# Altium schematic sheet Adafruit Bluefruit LE SPI Friend.SchDoc: Adafruit Bluefruit LE SPI Friend
size 282 x 197 mm; Date: 4/25/2020 9:23:17 PM; SheetNumber: 1; Author: KTOWN; Origin: Eagle; GateName_1: G$1; SymbolName_1: FRAME_A4_ADAFRUIT; LibraryName: microbuilder; DeviceSetName: FRAME_A4_ADAFRUIT; Sheet: Sheet:; AdafruitIndustries: Adafruit Industries; Drawing: Drawing:
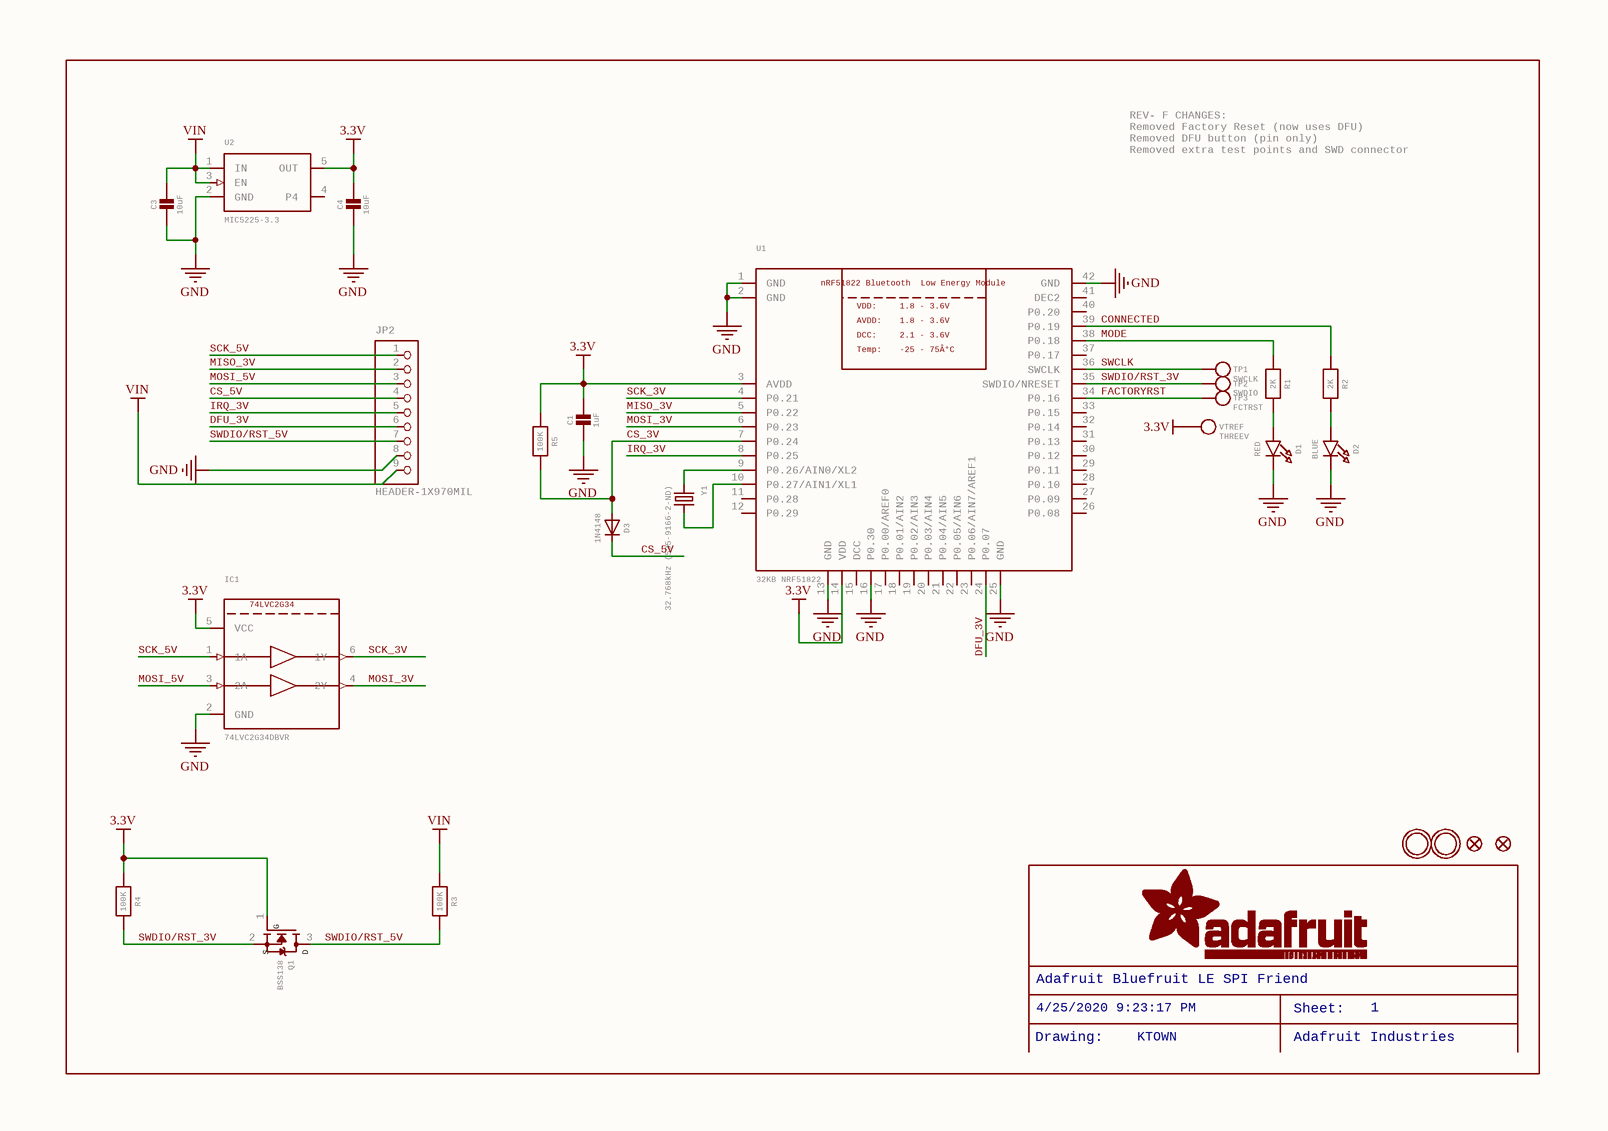
[diagram p0: Adafruit Bluefruit LE SPI Friend.SchDoc]

## Parts
C1  value 1uF  [0805_10MGAP]
C3  value 10uF  [0805-NO]
C4  value 10uF  [0805_10MGAP]
D1  value RED  [CHIPLED_0805_NOOUTLINE]
D2  value BLUE  [CHIPLED_0805_NOOUTLINE]
D3  value 1N4148  [SOD-323]
FID1  FIDUCIAL""  [FIDUCIAL_1MM]  (value not drawn)
FID3  FIDUCIAL""  [FIDUCIAL_1MM]  (value not drawn)
IC1  74LVC2G34DBVR  [SOT23-6]
JP2  HEADER-1X970MIL  [1X09_ROUND_70]
Q1  value BSS138  [SOT23-WIDE@1]
R1  value 2K  [_0805MP]
R2  value 2K  [_0805MP]
R3  value 100K  [0805-NO]
R4  value 100K  [0805-NO]
R5  value 100K  [_0805MP]
TP1  value SWCLK  [PAD-1.5X2.0]
TP2  value SWDIO  [PAD-1.5X2.0]
TP3  value FCTRST  [PAD-1.5X2.0]
U1  value 32KB NRF51822  nRF51822Bluetooth
LowEnergyModule: nRF51822 Bluetooth / Low Energy Module  AVDD: AVDD:  VDD: VDD:  Temp: Temp:  DCC: DCC:  1.8-3.6V: 1.8 - 3.6V  2.1-3.6V: 2.1 - 3.6V  -25-75Â°C: -25 - 75Â°C  [BLE_MODULE_RAYTAC_MDBT40]
U2  value MIC5225-3.3  [SOT23-5]
U$28  MOUNTINGHOLE2.5  [MOUNTINGHOLE_2.5_PLATED]  (value not drawn)
U$29  MOUNTINGHOLE2.5  [MOUNTINGHOLE_2.5_PLATED]  (value not drawn)
VTREF  value THREEV  [PAD-1.5X2.0]
Y1  value 32.768kHz (535-9166-2-ND)  [CRYSTAL_CYL_2X6MM_SMT]

## Nets
3.3V: C1.1 C4.1 IC1.5(VCC) Q1.1(G) R4.1 R5.1 U1.3(AVDD) U1.14(VDD) U2.5(OUT) VTREF.P$1
GND: C1.2 C3.2 C4.2 D1.C D2.C IC1.2(GND) JP2.8 U1.1(GND) U1.2(GND) U1.13(GND) U1.16(P0.30) U1.25(GND) U1.42(GND) U2.2(GND)
VIN: C3.1 JP2.9 R3.1 U2.1(IN) U2.3(EN)
CONNECTED: R2.1 U1.39(P0.19)
CS_3V: D3.A R5.2 U1.7(P0.24)
CS_5V: D3.C JP2.4
DFU_3V: JP2.6 U1.24(P0.07)
FACTORYRST: TP3.P$1 U1.34(P0.16)
IRQ_3V: JP2.5 U1.8(P0.25)
MISO_3V: JP2.2 U1.5(P0.22)
MODE: R1.1 U1.38(P0.18)
MOSI_3V: IC1.4(2Y) U1.6(P0.23)
MOSI_5V: IC1.3(2A) JP2.3
SCK_3V: IC1.6(1Y) U1.4(P0.21)
SCK_5V: IC1.1(1A) JP2.1
SWCLK: TP1.P$1 U1.36(SWCLK)
SWDIO/RST_3V: Q1.2(S) R4.2 TP2.P$1 U1.35(SWDIO/NRESET)
SWDIO/RST_5V: JP2.7 Q1.3(D) R3.2
NetD1_A: D1.A R1.2
NetD2_A: D2.A R2.2
NetU1_9: U1.9(P0.26/AIN0/XL2) Y1.1
NetU1_10: U1.10(P0.27/AIN1/XL1) Y1.2

Not connected (* = marked no-connect by the designer): U1 11(P0.28) 12(P0.29) 15(DCC) 17(P0.00/AREF0) 18(P0.01/AIN2) 19(P0.02/AIN3) 20(P0.03/AIN4) 21(P0.04/AIN5) 22(P0.05/AIN6) 23(P0.06/AIN7/AREF1) 26(P0.08) 27(P0.09) 28(P0.10) 29(P0.11) 30(P0.12) 31(P0.13) 32(P0.14) 33(P0.15) 37(P0.17) 40(P0.20) 41(DEC2); U2 4(P4)

## Notes on the sheet
- REV- F CHANGES:
  Removed Factory Reset (now uses DFU)
  Removed DFU button (pin only)
  Removed extra test points and SWD connector
- Adafruit Bluefruit LE SPI Friend
- 4/25/2020 9:23:17 PM
- Sheet:
- 1
- Drawing:
- KTOWN
- Adafruit Industries

## Library data of the parts
C1 C4 = CAP_CERAMIC0805_10MGAP: Ceramic Capacitors   For new designs, use the packages preceded by an '_' character since they are more reliable:   The following footprints should be used on most boards: _0402 - Standard footprint for regular board layouts  _0603 - Standard footprint for regular board layouts  _0805 - Standard footprint for regular board layouts  _1206 - Standard footprint for regular board layouts       For extremely tight-pitch boards where space is at a premium, the following 'micro-pitch' footprints can be used (smaller pads, no silkscreen outline, etc.): _0402MP - Micro-pitch footprint for very dense/compact boards  _0603MP - Micro-pitch footprint for very dense/compact boards  _0805MP - Micro-pitch footprint for very dense/compact boards  _1206MP - Micro-pitch footprint for very dense/compact boards; GateName_1: G$1; SymbolName_1: CAPACITOR; DeviceName: 0805_10MGAP; LibraryName: microbuilder; DeviceSetName: CAP_CERAMIC
C3 = CAP_CERAMIC0805-NOOUTLINE: Ceramic Capacitors   For new designs, use the packages preceded by an '_' character since they are more reliable:   The following footprints should be used on most boards: _0402 - Standard footprint for regular board layouts  _0603 - Standard footprint for regular board layouts  _0805 - Standard footprint for regular board layouts  _1206 - Standard footprint for regular board layouts       For extremely tight-pitch boards where space is at a premium, the following 'micro-pitch' footprints can be used (smaller pads, no silkscreen outline, etc.): _0402MP - Micro-pitch footprint for very dense/compact boards  _0603MP - Micro-pitch footprint for very dense/compact boards  _0805MP - Micro-pitch footprint for very dense/compact boards  _1206MP - Micro-pitch footprint for very dense/compact boards; GateName_1: G$1; SymbolName_1: CAPACITOR; DeviceName: 0805-NOOUTLINE; LibraryName: microbuilder; DeviceSetName: CAP_CERAMIC
D1 D2 = LED0805_NOOUTLINE: LED0603 - 0603 Surface Mount Package    2mA: Green LED - Low Power (3.9mcd, 2ma, 1.7Vf) - Digikey: 475-2709-2-ND  Orange LED - Low Power (9.8mcd, 2ma, 1.8Vf) - Digikey: 475-1194-2-ND  Red LED - Low Power (5mcd, 2ma, 1.8Vf) - Digikey: 475-1195-2-ND  Yellow LED - Low Power (7mcd, 2ma, 1.8Vf) - Digikey: 475-1196-2-ND       5mA: Blue LED - Low Power (17mcd, 5ma, 2.9Vf) - Digikey: LNJ937W8CRACT-ND    0805 - 0805 Surface Mount Package    2mA: Red LED (8.8mcd, 2mA, 1.8Vf, Clear) - Low Power [Digikey: 475-2510-1-ND]  Green LED (5mcd, 2mA, 1.8Vf, Clear) - Low Power [Digikey: 475-2730-1-ND]  Yellow LED (11.3mcd, 2mA, 1.8Vf, Clear) - Low Power [Digikey: 475-2555-1-ND]       20mA: Red LED (104mcd, 20mA, Diffused) - LS R976 [Digikey: 475-1278-6-ND]  Red LED (12mcd, 20mA, 2.0Vf, Clear) - APT2012EC [Digikey: 754-1128-1-ND]  Green LED (15mcd, 20mA, 2.2Vf, Clear) - APT2012GC [Digikey: 754-1131-1-ND]  Orange LED (160mcd, 20mA, 2.1Vf, Clear) - APT2012SECK [Digikey: 754-1130-1-ND]     1206 - 1206 Surface Mount Package  Green LED (26mcd, 20mA, Diffused) - LG N971  [Digikey: 475-1407-6-ND]  Red LED (15mcd, 20mA, Diffused) - LH N974 [Digikey: 475-1416-6-ND]     Cree - Cree High-Power Surface Mount LEDs  XPEBWT-L1-0000-00D50 - White 111lm 350mA 2.9Vf 6200K 110Â°  XTEAWT-00-0000-00000LEE3 - White 114lm 350mA 2.85Vf 5000K 115Â°     Everlight - Everlight 45-21 Series Surface Mount LEDs  45-21/QK2C-B2832AC2CB2/2T - Warm White 2000mcd 20mA 3.25Vf 3050K 120Â°  45-21/LK2C-B38452C4CB2/2T - Nuetral White 2000mcd 20mA 3.25Vf 4150K 120Â°  45-21/LK2C-B50634C6CB2/2T - Cold White 2200mcd 20mA 3.25Vf 5650K 120Â°     PLCC2 Reverse Mount LS T77K-J1L2-1-0-2-R18-Z - Red 11.25mcd 2mA 1.8Vf 630nm 120Â°  LO T77K-L1M2-24-Z - Orange 19.6mcd 2mA 1.8Vf 606nm 120Â°  LY T77K-K2M1-26-Z - Yellow 15.7mcd 2mA 1.8Vf 587nm 120Â°; GateName_1: G$1; SymbolName_1: LED; DeviceName: 0805_NOOUTLINE; LibraryName: microbuilder; DeviceSetName: LED
D3 = DIODESOD-323: Diode    SMA      Model	  Volts	  Amps	  Type	  Vf	  Ir	  Digikey #	  Notes	     SSA34-E3	  40V	  3A	  Schottky	  480mV @ 3A	  200uA @ 40V	  SSA34-E3/61TGITR-ND	  	     CDBA120-G	  20V	  1A	  Schottky	  500mV @ 1A	  500uA @ 20V	  641-1014-6-ND	  REEL	     MBRA210	  10V	  2A	  Schottky	  350mV @ 2A	  700uA @ 10V	  MBRA210LT3	  	 SOD-123      Model	  Volts	  Amps	  Type	  Vf	  Ir	  Order #	  Notes	     BAT54T1G	  30V	  200mA	  Schottky	  800mV @ 200mA	  2uA @ 25V	  BAT54T1GOSTR-ND	  	     B0530W	  30V	  500mA	  Schottky	  430mV @ 500mA	  130uA @ 30V	  B0530W-FDICT-ND	  REEL	     MBR120	  20V	  1A	  Schottky	  340mV @ 1A	  	  MBR120VLSFT1GOSCT-ND	  	 SOD-323      Model	  Volts	  Amps	  Type	  Vf	  Ir	  Order #	  Notes	     PMEG2005EJ	  20V	  500mA	  Schottky	  355mV @ 500mA	  	  568-4110-1-ND	  	     ZLLS410	  10V	  570mA	  Schottky	  380mV @ 570mA	  	  ZLLS410CT-ND	  	     1N4148WS	  75V	  150mA	  Silicon/Simple	  1V	  	  1N4148WSFSCT-ND	  REEL	 SOD-523      Model	  Volts	  Amps	  Type	  Vf	  Ir	  Order #	  Notes	     BAT54XV2	  30V	  200mA	  Schottky	  0.8V @ 100mA	  	  BAT54XV2CT-ND	  	     TB751S	  30V	  30mA	  Schottky	  	  	  RB751S-40TE61CT-ND	  	 SOT23-R/W (R = Solder Paste/Reflow Ovens, W = Hand-Soldering)       Model	  Volts	  Amps	  Type	  Vf	  Ir	  Order #	  Notes	     BAT54FILM	  40V	  300mA	  Schottky	  	  	  497-7162-1-ND	  	 POWERDI-5       Model	  Volts	  Amps	  Type	  Vf	  Ir	  Order #	  Notes	     PDS560	  60V	  5A	  Schottky	  670mV @ 5A	  150uA @ 60V	  PDS560DICT-ND; GateName_1: G$1; SymbolName_1: DIODE; DeviceName: SOD-323; LibraryName: microbuilder; DeviceSetName: DIODE
FID1 FID3 = FIDUCIAL"": Fiducial Alignment Points   Various fiducial points for machine vision alignment.; GateName_1: G$1; DeviceName: ""; BOM: EXCLUDE; SymbolName_1: FIDUCIAL; LibraryName: microbuilder; DeviceSetName: FIDUCIAL
IC1 = 74LVC2G34DBVR: GateName_1: G$1; DeviceName: DBVR; SymbolName_1: 74LVC2G34; LibraryName: microbuilder; DeviceSetName: 74LVC2G34; 74LVC2G34: 74LVC2G34
JP2 = HEADER-1X970MIL: PIN HEADER; GateName_1: A; SymbolName_1: PINHD9; DeviceName: 70MIL; LibraryName: microbuilder; DeviceSetName: HEADER-1X9
Q1 = MOSFET-NWIDE: N-Channel Mosfet   LEGEND   VDS: Voltage Drain-Source ID: Drain Current RDS(ON): Drain-Source On-State Resistance VGS(TH): Gate-Source Threshold Voltage CISS: Drain-Source Input Capacitance    SOT-23   Name	VDS	ID	RDS(ON)	VGS(TH)	CISS	Order Number	   2N7002E	60V	260mA	2.5 Ohm	2.5V @ 250uA	26.7pF @ 25V	2N7002ET1GOSTR-ND	   BSH103	30V	850mA	400 mOhm	400mV @ 1mA	83pF @ 24V	BSH103,235-ND	   BSS138	60V	320mA	1.6 Ohm	1.5V @ 250uA	50pF @ 10V	Mouser: 771-BSS138PW115	   DMN2075U-7	20V	4.2A	38 mOhm	1V @ 250 uA	594.3pF @ 10V	DMN2075U-7DICT-ND	   							   * BSS138 good choice for I2C level-shifting; GateName_1: G$1; DeviceName: WIDE; SymbolName_1: MOSFET-N; LibraryName: microbuilder; DeviceSetName: MOSFET-N; D: D; S: S; G: G
R1 R2 R5 = RESISTOR_0805MP: Resistors   For new designs, use the packages preceded by an '_' character since they are more reliable:   The following footprints should be used on most boards: _0402 - Standard footprint for regular board layouts  _0603 - Standard footprint for regular board layouts  _0805 - Standard footprint for regular board layouts  _1206 - Standard footprint for regular board layouts       For extremely tight-pitch boards where space is at a premium, the following 'micro-pitch' footprints can be used (smaller pads, no silkscreen outline, etc.): _0402MP - Micro-pitch footprint for very dense/compact boards  _0603MP - Micro-pitch footprint for very dense/compact boards  _0805MP - Micro-pitch footprint for very dense/compact boards  _1206MP - Micro-pitch footprint for very dense/compact boards; GateName_1: G$1; SymbolName_1: RESISTOR; DeviceName: _0805MP; LibraryName: microbuilder; DeviceSetName: RESISTOR
R3 R4 = RESISTOR0805_NOOUTLINE: Resistors   For new designs, use the packages preceded by an '_' character since they are more reliable:   The following footprints should be used on most boards: _0402 - Standard footprint for regular board layouts  _0603 - Standard footprint for regular board layouts  _0805 - Standard footprint for regular board layouts  _1206 - Standard footprint for regular board layouts       For extremely tight-pitch boards where space is at a premium, the following 'micro-pitch' footprints can be used (smaller pads, no silkscreen outline, etc.): _0402MP - Micro-pitch footprint for very dense/compact boards  _0603MP - Micro-pitch footprint for very dense/compact boards  _0805MP - Micro-pitch footprint for very dense/compact boards  _1206MP - Micro-pitch footprint for very dense/compact boards; GateName_1: G$1; SymbolName_1: RESISTOR; DeviceName: 0805_NOOUTLINE; LibraryName: microbuilder; DeviceSetName: RESISTOR
TP1-TP3 VTREF = TESTPOINT1.5X2.0MM_NOCREAM: Test Point   Various test points for characterisation and PCB testing    TESTPOINT_SMT - Compact Surface Mount Test Point [Digikey: 5016KTR-ND]; GateName_1: G$1; SymbolName_1: TESTPOINT; DeviceName: 1.5X2.0MM_NOCREAM; LibraryName: microbuilder; DeviceSetName: TESTPOINT
U1 = NRF51822_MODULE_MDBT40: nRF51822 Bluetooth Low Energy Module; GateName_1: G$1; SymbolName_1: BLE_MODULE_RAYTAC_MDBT40; LibraryName: microbuilder; DeviceSetName: NRF51822_MODULE_MDBT40
U2 = VREG_SOT23-5: SOT23-5 Fixed Voltage Regulators      Part	Current Out	V Out	V In	V Dropout	Î¸JA (Â°C/W)	TJ (Â°C)	Digikey Part No.	     ADP121	  150mA	  3.3V	  3.4-5.5V	  0.09V @ 150mA	  --	  --	  ADP121-AUJZ33R7CT-ND	     ADP121	  150mA	  3.0V	  3.1-5.5V	  0.09V @ 150mA	  --	  --	  ADP121-AUJZ30R7CT-ND	     ADP122	  300mA	  3.3V	  3.4-5.5V	  0.085V @ 300mA	  --	  --	  ADP122AUJZ-3.3-R7CT-ND	     ADP1712	  300mA	  3.3V	  3.5-5.5V	  0.17V @ 300mA	  --	  --	  ADP1712AUJZ-3.3-R7TR-ND	     AP7311 (Low Cost)	  150mA	  3.3V	  3.5-6V	  0.15V @ 150mA	  --	  --	  AP7311-33WG-7DICT-ND	     LD39015M18R	  150mA	  1.8V	  1.9V-5.5V	  0.08V @ 100mA	  --	  --	  497-6977-1-ND	     LP2985A-33DBVR	  150mA	  3.3V	  3.3-16V	  0.28V @ 150mA	  206	  150	  296-18479-1-ND	     MCP1824T-3302E/OT	  300mA	  3.3V	  3.5V-6V	  0.2V @ 300mA	  --	  --	  MCP1824T-3302E/OTCT-ND	     MIC5205-2.5YM5 TR	  150mA	  2.5V	  2.7-16V	  0.165V @ 150mA	  --	  --	  576-1257-2-ND	     MIC5205-3.0YM5 TR	  150mA	  3.0V	  3.2V-16V	  0.165V @ 150mA	  --	  --	  576-1258-2-ND	     MIC5205-3.3YM5 TR	  150mA	  3.3V	  3.5V-16V	  0.165V @ 150mA	  --	  --	  576-1259-2-ND	     TPS780330220	  150mA	  3.3V+2.2V	  3.6-5.5V	  250mV Max	  --	  --	  296-23332-1-ND	     TDA3663/N1,135	  100mA	  3.3V	  3.5-45V	  0.18V @ 50mA	  --	  --	  568-5343-1-ND	     	  	  	  	  	  	  	  	     	  	  	  	  	  	  	  	   Max operating temp can be calculated using Î¸JA, TJ (max junction temperature), and power in watts.  Set the "Maximum Ambient Temperature" until it reaches TJ ("Max Junction Temperature"), which is the absolute limit for safe use of the regulator: Heat Sink Temperature Calculator   For example, With 12V source into a 3.3V LP2985 and a 30mA load, we are dissipating (12V-3.3V) * 0.03A = 0.261W.  With a Î¸JA of 206 Â°C/W, a TJ of 150Â°C, and 261mW we can safely use the chip without a heat sink up to 75Â°C (=147.1Â°C Junction Temperature).; GateName_1: G$1; SymbolName_1: VREG_SOT23-5; LibraryName: microbuilder; DeviceSetName: VREG_SOT23-5
U$28 U$29 = MOUNTINGHOLE2.5: Mounting Hole   For #2 screws (0.086"/2.18mm width, 0.094"/2.4mm hole) use 2.5mm; GateName_1: G$1; DeviceName: 2.5; BOM: EXCLUDE; SymbolName_1: MOUNTINGHOLE; LibraryName: microbuilder; DeviceSetName: MOUNTINGHOLE
Y1 = CRYSTAL2.0X6.0_32.768: Crystals   HC49UP - Surface Mount Crystal  4.0MHz 18pF +/-30ppm Surface Mount Crystal [Digikey: 535-9857-1-ND]  12.0 MHz Surface Mount Crystal [Digikey: 535-9869-6-ND]  25.0 MHz Surface Mount Crystal [Digikey: 535-9078-1-ND]       2.5 x 2.0mm - MEMs SMT Crystal  16.0 MHz 10pF 20ppm 2.5 x 2.0mm Crystal [Digikey -40-85Â°C: 535-10923-1-ND]       3.2 x 2.5mm - MEMs SMT Crystal  12.0 MHz 8pF 15ppm 3.2 x 2.5mm Crystal [Digikey: -10-70Â°C: 644-1047-1-ND -40-125Â°C: 644-1128-1-ND] 40~85Â°C cheaper: 644-1173-6-ND  16.0 MHz 8pF 15ppm 3.2 x 2.5mm Crystal [Digikey: -10-70Â°C: 644-1049-1-ND -40-125Â°C: 644-1129-2-ND]-40~85Â°C cheaper: 644-1175-6-ND  16.0 MHz 10pF 10ppm 3.2 x 2.5mm Crystal [Digikey: 644-1100-1-ND]  27.12 MHz 18pF 30ppm 3.2 x 2.5mm Crystal [Digikey: 887-1424-1-ND]  27.12MHz 10pF 10ppm 3.2 x 2.5mm Crystal [Digikey: 887-1329-1-ND]       4.9 x 1.8mm - MEMs SMT Crystal  32.768 KHz 12.5pF 20ppm 4.9 x 1.8mm Crystal [Digikey: SE2415CT-ND]       8.0 x 3.8mm - Surface Mount Crystal  32.768kHz 12.5pF 20ppm -40Â°C-85Â°C [Digikey: 535-9166-2-ND]       Cylinder 32.768KHz Cylinder Crystal (2x6mm body) [Ex. Digikey: 300-8341-2-ND]; GateName_1: G$1; SymbolName_1: CRYSTAL; DeviceName: 2.0X6.0_32.768; LibraryName: microbuilder; DeviceSetName: CRYSTAL